# Altium schematic sheet [5] SDRAM.SchDoc
size A4
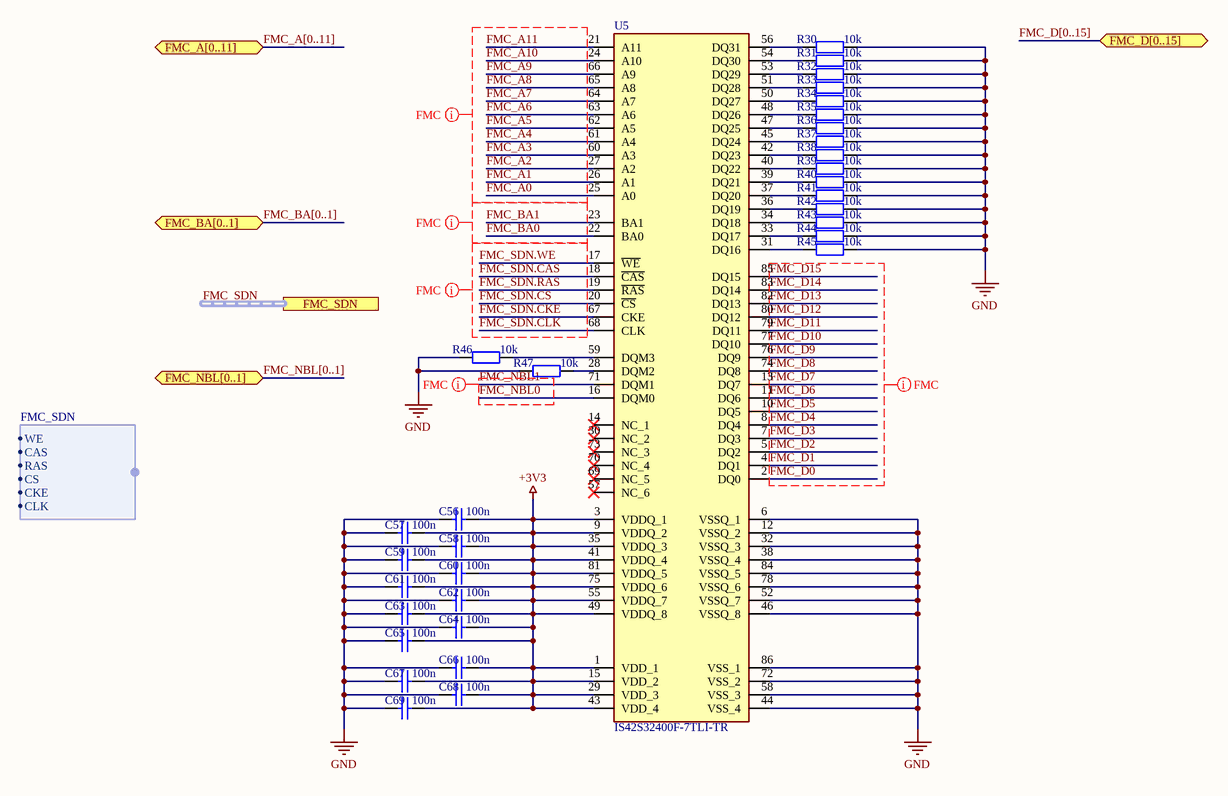
[diagram p0: [5] SDRAM.SchDoc]

## Parts
C56  100n  [Capacitor 0603]
C57  100n  [Capacitor 0603]
C58  100n  [Capacitor 0603]
C59  100n  [Capacitor 0603]
C60  100n  [Capacitor 0603]
C61  100n  [Capacitor 0603]
C62  100n  [Capacitor 0603]
C63  100n  [Capacitor 0603]
C64  100n  [Capacitor 0603]
C65  100n  [Capacitor 0603]
C66  100n  [Capacitor 0603]
C67  100n  [Capacitor 0603]
C68  100n  [Capacitor 0603]
C69  100n  [Capacitor 0603]
R30  10k  [Resistor 0603]
R31  10k  [Resistor 0603]
R32  10k  [Resistor 0603]
R33  10k  [Resistor 0603]
R34  10k  [Resistor 0603]
R35  10k  [Resistor 0603]
R36  10k  [Resistor 0603]
R37  10k  [Resistor 0603]
R38  10k  [Resistor 0603]
R39  10k  [Resistor 0603]
R40  10k  [Resistor 0603]
R41  10k  [Resistor 0603]
R42  10k  [Resistor 0603]
R43  10k  [Resistor 0603]
R44  10k  [Resistor 0603]
R45  10k  [Resistor 0603]
R46  10k  [Resistor 0603]
R47  10k  [Resistor 0603]
U5  IS42S32400F-7TLI-TR  [TSOP86]

## Ports
FMC_A[0..11] (bidir), FMC_BA[0..1] (bidir), FMC_D[0..15] (bidir), FMC_NBL[0..1] (bidir), FMC_SDN (harness FMC_SDN)

## Harnesses
FMC_SDN: CAS, WE, RAS, CS, CKE, CLK

## Nets
+3V3: C56.2 C57.2 C58.2 C59.2 C60.2 C61.2 C62.2 C63.2 C64.2 C65.2 C66.2 C67.2 C68.2 C69.2 U5.1(VDD_1) U5.3(VDDQ_1) U5.9(VDDQ_2) U5.15(VDD_2) U5.29(VDD_3) U5.35(VDDQ_3) U5.41(VDDQ_4) U5.43(VDD_4) U5.49(VDDQ_8) U5.55(VDDQ_7) U5.75(VDDQ_6) U5.81(VDDQ_5)
GND: C56.1 C57.1 C58.1 C59.1 C60.1 C61.1 C62.1 C63.1 C64.1 C65.1 C66.1 C67.1 C68.1 C69.1 R30.2 R31.2 R32.2 R33.2 R34.2 R35.2 R36.2 R37.2 R38.2 R39.2 R40.2 R41.2 R42.2 R43.2 R44.2 R45.2 R46.1 R47.1 U5.6(VSSQ_1) U5.12(VSSQ_2) U5.32(VSSQ_3) U5.38(VSSQ_4) U5.44(VSS_4) U5.46(VSSQ_8) U5.52(VSSQ_7) U5.58(VSS_3) U5.72(VSS_2) U5.78(VSSQ_6) U5.84(VSSQ_5) U5.86(VSS_1)
FMC_A0: U5.25(A0)
FMC_A1: U5.26(A1)
FMC_A2: U5.27(A2)
FMC_A3: U5.60(A3)
FMC_A4: U5.61(A4)
FMC_A5: U5.62(A5)
FMC_A6: U5.63(A6)
FMC_A7: U5.64(A7)
FMC_A8: U5.65(A8)
FMC_A9: U5.66(A9)
FMC_A10: U5.24(A10)
FMC_A11: U5.21(A11)
FMC_BA0: U5.22(BA0)
FMC_BA1: U5.23(BA1)
FMC_D0: U5.2(DQ0)
FMC_D1: U5.4(DQ1)
FMC_D2: U5.5(DQ2)
FMC_D3: U5.7(DQ3)
FMC_D4: U5.8(DQ4)
FMC_D5: U5.10(DQ5)
FMC_D6: U5.11(DQ6)
FMC_D7: U5.13(DQ7)
FMC_D8: U5.74(DQ8)
FMC_D9: U5.76(DQ9)
FMC_D10: U5.77(DQ10)
FMC_D11: U5.79(DQ11)
FMC_D12: U5.80(DQ12)
FMC_D13: U5.82(DQ13)
FMC_D14: U5.83(DQ14)
FMC_D15: U5.85(DQ15)
FMC_NBL0: U5.16(DQM0)
FMC_NBL1: U5.71(DQM1)
FMC_SDN.CAS: U5.18(~{CAS})
FMC_SDN.CKE: U5.67(CKE)
FMC_SDN.CLK: U5.68(CLK)
FMC_SDN.CS: U5.20(~{CS})
FMC_SDN.RAS: U5.19(~{RAS})
FMC_SDN.WE: U5.17(~{WE})
NetR30_1: R30.1 U5.56(DQ31)
NetR31_1: R31.1 U5.54(DQ30)
NetR32_1: R32.1 U5.53(DQ29)
NetR33_1: R33.1 U5.51(DQ28)
NetR34_1: R34.1 U5.50(DQ27)
NetR35_1: R35.1 U5.48(DQ26)
NetR36_1: R36.1 U5.47(DQ25)
NetR37_1: R37.1 U5.45(DQ24)
NetR38_1: R38.1 U5.42(DQ23)
NetR39_1: R39.1 U5.40(DQ22)
NetR40_1: R40.1 U5.39(DQ21)
NetR41_1: R41.1 U5.37(DQ20)
NetR42_1: R42.1 U5.36(DQ19)
NetR43_1: R43.1 U5.34(DQ18)
NetR44_1: R44.1 U5.33(DQ17)
NetR45_1: R45.1 U5.31(DQ16)
NetR46_2: R46.2 U5.59(DQM3)
NetR47_2: R47.2 U5.28(DQM2)

Not connected (* = marked no-connect by the designer): U5 14(NC_1)* 30(NC_2)* 57(NC_6)* 69(NC_5)* 70(NC_4)* 73(NC_3)*

## Buses and harness runs
bus FMC_A[0..11] = port FMC_A[0..11]
bus FMC_BA[0..1] = port FMC_BA[0..1]
bus FMC_D[0..15] = port FMC_D[0..15]
bus FMC_NBL[0..1] = port FMC_NBL[0..1]
harness FMC_SDN = port FMC_SDN

## Layout directives
net class FMC: FMC_A0, FMC_A1, FMC_A2, FMC_A3, FMC_A4, FMC_A5, FMC_A6, FMC_A7, FMC_A8, FMC_A9, FMC_A10, FMC_A11, FMC_BA0, FMC_BA1, FMC_D0, FMC_D1, FMC_D2, FMC_D3, FMC_D4, FMC_D5, FMC_D6, FMC_D7, FMC_D8, FMC_D9, FMC_D10, FMC_D11, FMC_D12, FMC_D13, FMC_D14, FMC_D15, FMC_NBL1, FMC_SDN.CAS, FMC_SDN.CKE, FMC_SDN.CLK, FMC_SDN.CS, FMC_SDN.RAS, FMC_SDN.WE

## Library data of the parts
C56-C69 = Capacitor 100n 10% 0603 EMK107B7104KA-T: Multilayer Ceramic Capacitors MLCC - SMD/SMT 0603 16VDC 0.1uF 10% X7R; Manufacturer: Taiyo Yuden; Type: SMD; Manufacturer Part Number: EMK107B7104KA-T; Footprint: 0603; Datasheet: https://pl.mouser.com/datasheet/2/396/mlcc02_e-1307760.pdf
R30-R47 = Resistor 10k 1% 0603 RT0603FRE0710KL: Thin Film Resistors - SMD 10K ohm 1% 1/10W; Manufacturer: Yageo; Manufacturer Part Number: RT0603FRE0710KL; Footprint: 0603; Type: SMD; Datasheet: https://pl.mouser.com/datasheet/2/447/PYu_RT_1_to_0_01_RoHS_L_11-1669912.pdf
U5 = IC DRAM 128M 4Mx32 143Mhz SDRAM, 3.3V IS42S32400F-7TLI-TR: DRAM 128M 4Mx32 143Mhz SDRAM, 3.3v; Manufacturer: ISSI; Manufacturer Part Number: IS42S32400F-7TLI-TR; Footprint: TSOP-86; Type: SMD; Datasheet: https://pl.mouser.com/datasheet/2/198/42-45S32400F-258273.pdf